# EAGLE design outlet_tester (EAGLE 6.4)
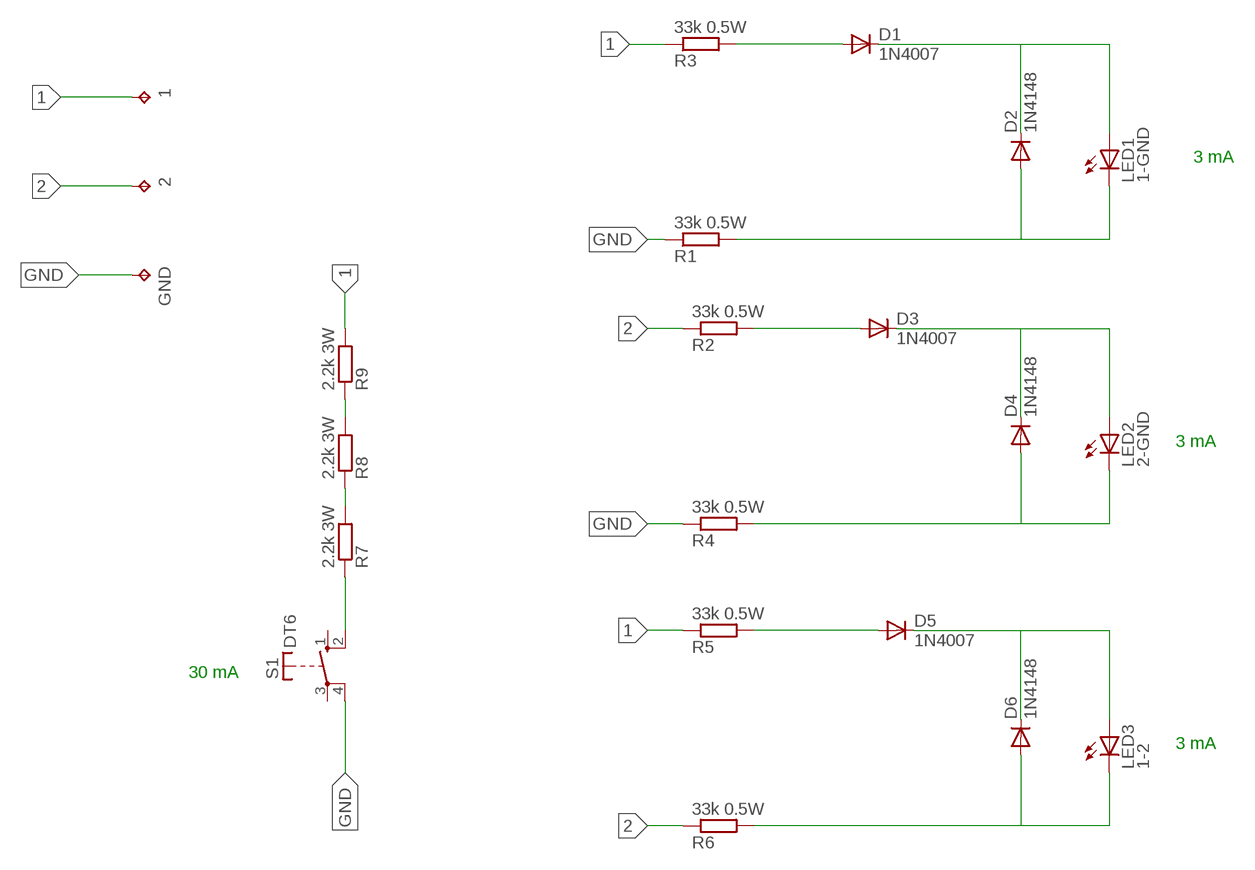
[diagram p0: schematic, sheet 1]

## Parts
1  TPPAD1-20  [P1-20]
2  TPPAD1-20  [P1-20]
D1  1N4007  DIODE-D-10  [D-10]
D2  1N4148  DIODE-D-10  [D-10]
D3  1N4007  DIODE-D-10  [D-10]
D4  1N4148  DIODE-D-10  [D-10]
D5  1N4007  DIODE-D-10  [D-10]
D6  1N4148  DIODE-D-10  [D-10]
GND  TPPAD1-20  [P1-20]
LED1  1-GND  LED5MM  [LED5MM]
LED2  2-GND  LED5MM  [LED5MM]
LED3  1-2  LED5MM  [LED5MM]
R1  33k 0.5W  R-EU_0207/10  [0207/10]
R2  33k 0.5W  R-EU_0207/10  [0207/10]
R3  33k 0.5W  R-EU_0207/10  [0207/10]
R4  33k 0.5W  R-EU_0207/10  [0207/10]
R5  33k 0.5W  R-EU_0207/10  [0207/10]
R6  33k 0.5W  R-EU_0207/10  [0207/10]
R7  2.2k 3W  R-EU_0207/10  [0207/10]
R8  2.2k 3W  R-EU_0207/10  [0207/10]
R9  2.2k 3W  R-EU_0207/10  [0207/10]
S1  DT6  [DT6]

## Nets
1: 1.TP R3.1 R5.1 R9.2
2: 2.TP R2.1 R6.1
GND: GND.TP R1.1 R4.1 S1.4(P)
N$1: R7.1 S1.2(S)
N$2: D1.C D2.C LED1.A
N$3: D2.A LED1.K(C) R1.2
N$4: D1.A R3.2
N$5: D3.A R2.2
N$6: D5.A R5.2
N$7: D3.C D4.C LED2.A
N$8: D4.A LED2.K(C) R4.2
N$9: R7.2 R8.1
N$10: R8.2 R9.1
N$12: D5.C D6.C LED3.A
N$13: D6.A LED3.K(C) R6.2
Unconnected: S1.1(S) S1.3(P)

## Notes on the sheet
- 3 mA
- 3 mA
- 30 mA
- 3 mA

## Library data of the parts
1 2 GND = testpad:TP: Test pad
D1-D6 = diode:DIODE-: DIODE
LED1-LED3 = led:LED: LED OSRAM: - CHIPLED LG R971, LG N971, LY N971, LG Q971, LY Q971, LO R971, LY R971 LH N974, LH R974 LS Q976, LO Q976, LY Q976 LO Q996 - Hyper CHIPLED LW Q18S LB Q993, LB Q99A, LB R99A - SideLED LS A670, LO A670, LY A670, LG A670, LP A670 LB A673, LV A673, LT A673, LW A673 LH A674 LY A675 LS A676, LA A676, LO A676, LY A676, LW A676 LS A679, LY A679, LG A679 - Hyper Micro SIDELED® LS Y876, LA Y876, LO Y876, LY Y876 LT Y87S - SmartLED LW L88C, LW L88S LB L89C, LB L89S, LG L890 LS L89K, LO L89K, LY L89K LS L896, LA L896, LO L896, LY L896 - TOPLED LS T670, LO T670, LY T670, LG T670, LP T670 LSG T670, LSP T670, LSY T670, LOP T670, LYG T670 LG T671, LOG T671, LSG T671 LB T673, LV T673, LT T673, LW T673 LH T674 LS T676, LA T676, LO T676, LY T676, LB T676, LH T676, LSB T676, LW T676 LB T67C, LV T67C, LT T67C, LS T67K, LO T67K, LY T67K, LW E67C LS E67B, LA E67B, LO E67B, LY E67B, LB E67C, LV E67C, LT E67C LW T67C LS T679, LY T679, LG T679 LS T770, LO T770, LY T770, LG T770, LP T770 LB T773, LV T773, LT T773, LW T773 LH T774 LS E675, LA E675, LY E675, LS T675 LS T776, LA T776, LO T776, LY T776, LB T776 LHGB T686 LT T68C, LB T68C - Hyper Mini TOPLED® LB M676 - Mini TOPLED Santana® LG M470 LS M47K, LO M47K, LY M47K Source: http://www.osram.convergy.de LUXEON: - LUMILED® LXK2-PW12-R00, LXK2-PW12-S00, LXK2-PW14-U00, LXK2-PW14-V00 LXK2-PM12-R00, LXK2-PM12-S00, LXK2-PM14-U00 LXK2-PE12-Q00, LXK2-PE12-R00, LXK2-PE12-S00, LXK2-PE14-T00, LXK2-PE14-U00 LXK2-PB12-K00, LXK2-PB12-L00, LXK2-PB12-M00, LXK2-PB14-N00, LXK2-PB14-P00, LXK2-PB14-Q00 LXK2-PR12-L00, LXK2-PR12-M00, LXK2-PR14-Q00, LXK2-PR14-R00 LXK2-PD12-Q00, LXK2-PD12-R00, LXK2-PD12-S00 LXK2-PH12-R00, LXK2-PH12-S00 LXK2-PL12-P00, LXK2-PL12-Q00, LXK2-PL12-R00 Source: www.luxeon.com KINGBRIGHT: KA-3528ASYC Source: www.kingbright.com
R1-R9 = rcl:R-EU_: RESISTOR, European symbol
S1 = switch-misc:DT: ITT SWITCH

## Board
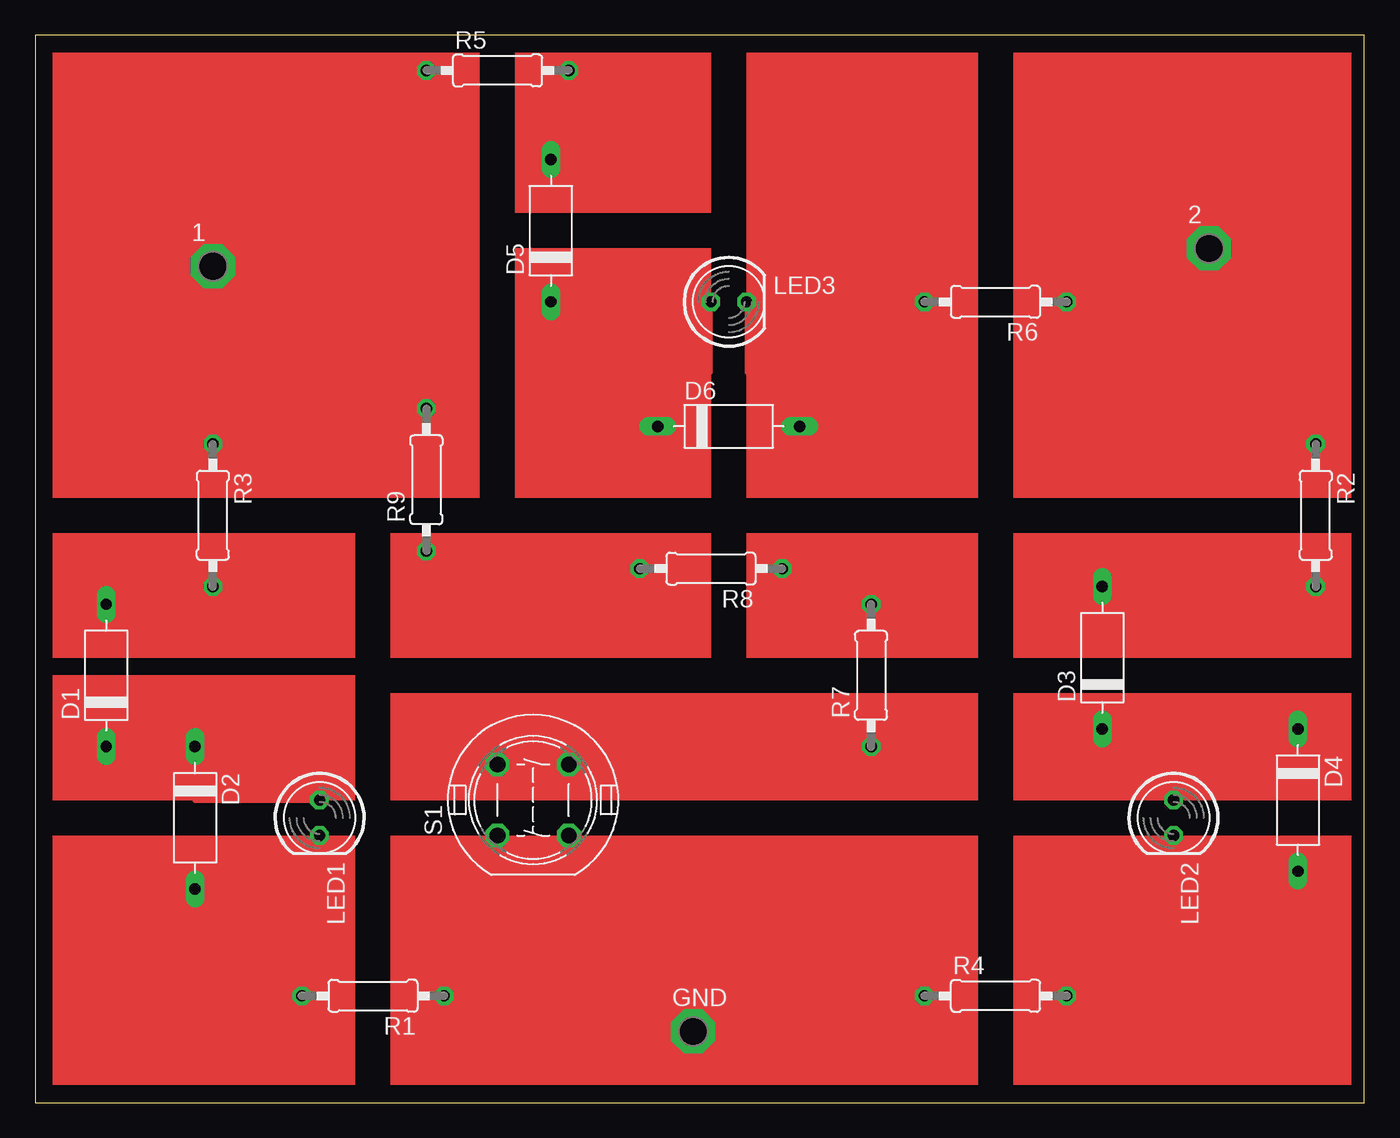
[diagram p1: board, top side]

Size 94.92 x 76.19 mm. Coordinates in mm from the lower left corner, seen from the top.
Outline: 0,0 94.92,0 94.92,76.19 0,76.19 0,0
Copper layers (1*16): Top 0.035mm / dielectric 1.5mm / Bottom 0.035mm
Design rules "default": minimum track width 10mil, minimum drill 24mil, track to track 8mil, track to pad 8mil, pad to pad 8mil, via to via 8mil, smd to smd 8mil, copper to edge 40mil, drill to drill 8mil, minimum pad ring 10mil, minimum via ring 8mil, stop-mask expansion 4mil, vias tented up to drill 0mil, thermal gap 10mil

### Footprints (pad centres in the part's own frame; a part is rotated, then mirrored left to right if it is on the bottom)
P1-20 = drill 2.007 pad 3.15 octagon: TP 0,0
D-10 = drill 0.813 long: A 5.08,0; C -5.08,0
LED5MM = drill 0.813 octagon: A -1.27,0; K 1.27,0
0207/10 = drill 0.813 octagon: 1 -5.08,0; 2 5.08,0
DT6 = drill 1.118 octagon: 1 -2.54,2.54; 2 2.54,2.54; 3 2.54,-2.54; 4 -2.54,-2.54

### Placement (x,y rotation side)
1  12.7,59.69 0 top
2  83.82,60.96 0 top
D1  5.08,30.48 90 top
D2  11.43,20.32 270 top
D3  76.2,31.75 90 top
D4  90.17,21.59 270 top
D5  36.83,62.23 90 top
D6  49.53,48.26 0 top
GND  46.99,5.08 0 top
LED1  20.32,20.32 270 top
LED2  81.28,20.32 270 top
LED3  49.53,57.15 0 top
R1  24.13,7.62 180 top
R2  91.44,41.91 270 top
R3  12.7,41.91 270 top
R4  68.58,7.62 0 top
R5  33.02,73.66 0 top
R6  68.58,57.15 180 top
R7  59.69,30.48 90 top
R8  48.26,38.1 180 top
R9  27.94,44.45 90 top
S1  35.56,21.59 90 top

### Tracks (layer width: path | path; a pad name or v marks a point on that pad's centre or on a via)
1
  Top 0.406: R5.1 26.67,73.66 1.TP R3.1 R9.2
2
  Top 0.254: R2.1 83.82,54.61 2.TP
  Top 0.406: R6.1 81.28,57.15 83.82,54.61
GND
  Top 0.406: R4.1 49.53,7.62 GND.TP 44.45,7.62 R1.1 33.02,12.7 S1.4
N$1
  Top 0.254: R7.1 36.83,26.67 S1.2
N$2
  Top 0.406: D1.C D2.C 11.43,21.59 LED1.A
N$3
  Top 0.406: D2.A 13.97,15.24 17.78,11.43 | 17.78,11.43 R1.2 | LED1.K 20.32,13.97 17.78,11.43
N$4
  Top 0.406: R3.2 6.35,36.83 D1.A
N$5
  Top 0.254: R2.2 D3.A
N$6
  Top 0.254: D5.A 38.1,68.58 R5.2
N$7
  Top 0.254: D3.C LED2.A
  Top 0.406: D4.C 86.36,26.67 LED2.A
N$8
  Top 0.254: R4.2 81.28,15.24 81.28,16.51 | LED2.K 81.28,16.51 | 81.28,16.51 D4.A
N$9
  Top 0.406: R7.2 R8.1
N$10
  Top 0.406: R8.2 R9.1
N$12
  Top 0.254: D6.C 48.26,52.07 LED3.A D5.C
N$13
  Top 0.254: D6.A 50.8,52.07 LED3.K R6.2
(copper drawn outside any net)
  shapes: Top area x15